# Altium schematic sheet Main.SchDoc
size 594 x 420 mm; SheetNumber: 1; Organization: Altium Limited; Address1: L3, 12a Rodborough Rd; Address2: Frenchs Forest; Address3: NSW; Address4: Australia 2086; PageSetup: Record=PageOptions|CenterHorizontal=False|CenterVertical=False|PrintScale=0.43|XCorrection=0.00|YCorrection=0.00|PrintKind=1|BorderSize=5000000|LeftOffset=0|BottomOffset=0|Orientation=2|PaperLength=5940|PaperWidth=4200|Scale=100|PaperSource=7|PrintQuality=-4|MediaType=1|DitherType=10|PaperKind=Personal. 1: 215,9 x 279,4 mm|PrintScaleMode=0
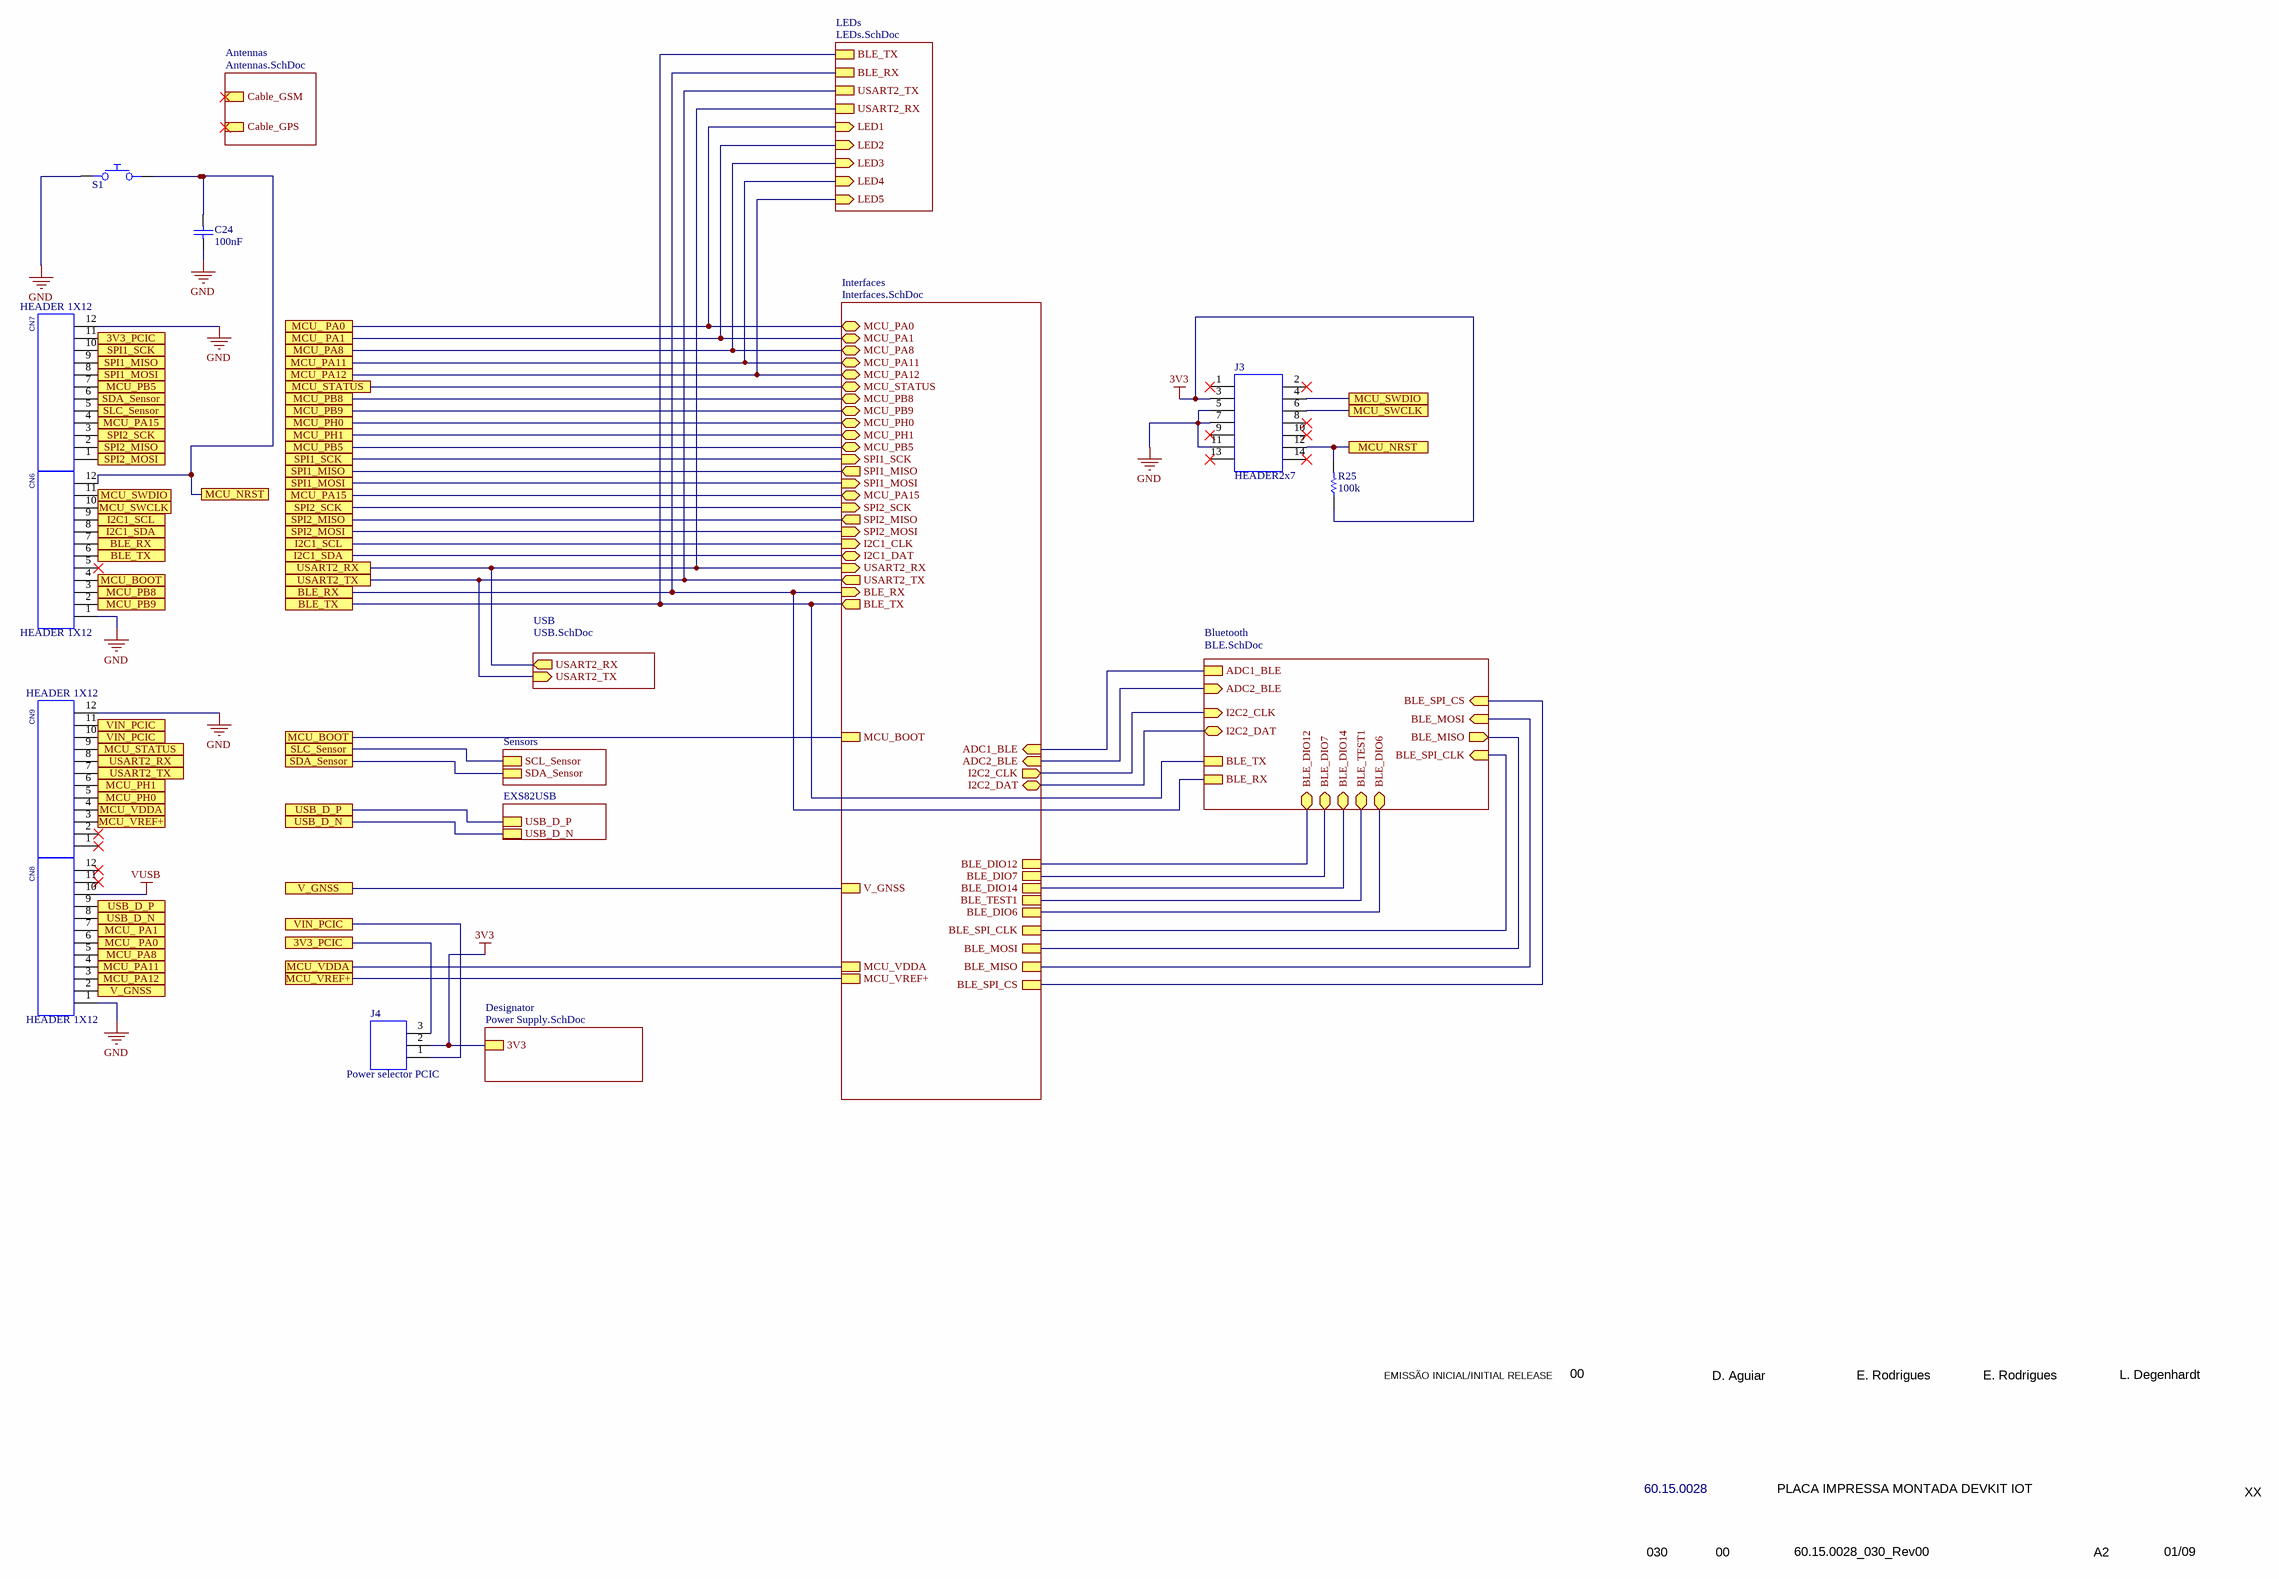
[diagram p0: Main.SchDoc]

## Parts
C24  Adicionado  [0201]  (value not drawn)
CN6  28.14.0552  [28.14.0552]  (value not drawn)
CN7  28.14.0552  [28.14.0552]  (value not drawn)
CN8  28.14.0552  [28.14.0552]  (value not drawn)
CN9  28.14.0552  [28.14.0552]  (value not drawn)
J3  value HEADER2x7  [70.11.0077]  (hidden comment: 70.11.0077)
J4  70.11.0083  [70.11.0083]  (value not drawn)
R25  value 100k  [0201]  (hidden comment: Adicionado)
S1  Adicionado  [PUSH_BUTTON]  (value not drawn)

## Sub-sheets
Antennas = Antennas.SchDoc: Cable_GSM, Cable_GPS
Bluetooth = BLE.SchDoc: ADC1_BLE, ADC2_BLE (in), I2C2_CLK (in), I2C2_DAT (bidir), BLE_TX, BLE_RX, BLE_SPI_CLK (in), BLE_MISO (out), BLE_MOSI (in), BLE_SPI_CS (in), BLE_DIO12 (bidir), BLE_DIO14 (bidir), BLE_DIO7 (bidir), BLE_DIO6 (bidir), BLE_TEST1 (bidir)
Designator = Power Supply.SchDoc: 3V3
EXS82USB = EXS82_USB.SchDoc: USB_D_P, USB_D_N
Interfaces = Interfaces.SchDoc: MCU_PB9 (bidir), MCU_PH0 (bidir), MCU_PH1 (bidir), MCU_PA0 (bidir), MCU_PA1 (bidir), MCU_PA8 (bidir), MCU_PA11 (bidir), MCU_PA12 (bidir), MCU_PA15 (bidir), SPI2_MOSI (in), SPI2_MISO (out), SPI2_SCK (in), I2C1_CLK (in), I2C1_DAT (bidir), SPI1_MOSI (in), SPI1_MISO (out), SPI1_SCK (in), USART2_RX (in), USART2_TX (out), BLE_TX (out), BLE_RX (in), ADC1_BLE (in), ADC2_BLE (in), MCU_PB5 (bidir), MCU_PB8 (bidir), BLE_DIO6, BLE_DIO7, BLE_DIO12, BLE_DIO14, BLE_TEST1, BLE_SPI_CS, BLE_SPI_CLK, BLE_MOSI, BLE_MISO, MCU_STATUS (bidir), MCU_BOOT, MCU_VDDA, MCU_VREF+, I2C2_CLK (out), I2C2_DAT (bidir), V_GNSS
LEDs = LEDs.SchDoc: LED1 (in), LED2 (in), LED3 (in), LED4 (in), LED5 (in), USART2_RX, USART2_TX, BLE_RX, BLE_TX
Sensors = Sensors.SchDoc: SCL_Sensor, SDA_Sensor
USB = USB.SchDoc: USART2_RX (out), USART2_TX (in)

## Ports
3V3_PCIC, BLE_RX, BLE_TX, I2C1_SCL, I2C1_SDA, MCU_ PA0, MCU_ PA1, MCU_BOOT, MCU_NRST, MCU_PA8, MCU_PA11, MCU_PA12, MCU_PA15, MCU_PB5, MCU_PB8, MCU_PB9, MCU_PH0, MCU_PH1, MCU_STATUS, MCU_SWCLK, MCU_SWDIO, MCU_VDDA, MCU_VREF+, SDA_Sensor, SLC_Sensor, SPI1_MISO, SPI1_MOSI, SPI1_SCK, SPI2_MISO, SPI2_MOSI, SPI2_SCK, USART2_RX, USART2_TX, USB_D_N, USB_D_P, V_GNSS, VIN_PCIC

## Nets
3V3: J3.3 J4.2 R25.1 ; sheet Designator/3V3
GND: C24.1 CN6.1 CN7.12 CN8.1 CN9.12 J3.5 J3.7 J3.11 S1.1
VUSB: CN8.10
3V3_PCIC: CN7.11 J4.3 ; port 3V3_PCIC
BLE_RX: CN6.7 ; port BLE_RX, sheet LEDs/BLE_RX, sheet Interfaces/BLE_RX, sheet Bluetooth/BLE_RX
BLE_TX: CN6.6 ; port BLE_TX, sheet LEDs/BLE_TX, sheet Interfaces/BLE_TX, sheet Bluetooth/BLE_TX
I2C1_SCL: CN6.9 ; port I2C1_SCL, sheet Interfaces/I2C1_CLK
I2C1_SDA: CN6.8 ; port I2C1_SDA, sheet Interfaces/I2C1_DAT
MCU_ PA0: CN8.6 ; port MCU_ PA0, sheet LEDs/LED1, sheet Interfaces/MCU_PA0
MCU_ PA1: CN8.7 ; port MCU_ PA1, sheet LEDs/LED2, sheet Interfaces/MCU_PA1
MCU_BOOT: CN6.4 ; port MCU_BOOT, sheet Interfaces/MCU_BOOT
MCU_NRST: C24.2 CN6.12 J3.12 R25.2 S1.2 ; port MCU_NRST
MCU_PA8: CN8.5 ; port MCU_PA8, sheet LEDs/LED3, sheet Interfaces/MCU_PA8
MCU_PA11: CN8.4 ; port MCU_PA11, sheet LEDs/LED4, sheet Interfaces/MCU_PA11
MCU_PA12: CN8.3 ; port MCU_PA12, sheet LEDs/LED5, sheet Interfaces/MCU_PA12
MCU_PA15: CN7.4 ; port MCU_PA15, sheet Interfaces/MCU_PA15
MCU_PB5: CN7.7 ; port MCU_PB5, sheet Interfaces/MCU_PB5
MCU_PB8: CN6.3 ; port MCU_PB8, sheet Interfaces/MCU_PB8
MCU_PB9: CN6.2 ; port MCU_PB9, sheet Interfaces/MCU_PB9
MCU_PH0: CN9.5 ; port MCU_PH0, sheet Interfaces/MCU_PH0
MCU_PH1: CN9.6 ; port MCU_PH1, sheet Interfaces/MCU_PH1
MCU_STATUS: CN9.9 ; port MCU_STATUS, sheet Interfaces/MCU_STATUS
MCU_SWCLK: CN6.10 J3.6 ; port MCU_SWCLK
MCU_SWDIO: CN6.11 J3.4 ; port MCU_SWDIO
MCU_VDDA: CN9.4 ; port MCU_VDDA, sheet Interfaces/MCU_VDDA
MCU_VREF+: CN9.3 ; port MCU_VREF+, sheet Interfaces/MCU_VREF+
SDA_Sensor: CN7.6 ; port SDA_Sensor, sheet Sensors/SDA_Sensor
SLC_Sensor: CN7.5 ; port SLC_Sensor, sheet Sensors/SCL_Sensor
SPI1_MISO: CN7.9 ; port SPI1_MISO, sheet Interfaces/SPI1_MISO
SPI1_MOSI: CN7.8 ; port SPI1_MOSI, sheet Interfaces/SPI1_MOSI
SPI1_SCK: CN7.10 ; port SPI1_SCK, sheet Interfaces/SPI1_SCK
SPI2_MISO: CN7.2 ; port SPI2_MISO, sheet Interfaces/SPI2_MISO
SPI2_MOSI: CN7.1 ; port SPI2_MOSI, sheet Interfaces/SPI2_MOSI
SPI2_SCK: CN7.3 ; port SPI2_SCK, sheet Interfaces/SPI2_SCK
USART2_RX: CN9.8 ; port USART2_RX, sheet LEDs/USART2_RX, sheet USB/USART2_RX, sheet Interfaces/USART2_RX
USART2_TX: CN9.7 ; port USART2_TX, sheet LEDs/USART2_TX, sheet USB/USART2_TX, sheet Interfaces/USART2_TX
USB_D_N: CN8.8 ; port USB_D_N, sheet EXS82USB/USB_D_N
USB_D_P: CN8.9 ; port USB_D_P, sheet EXS82USB/USB_D_P
V_GNSS: CN8.2 ; port V_GNSS, sheet Interfaces/V_GNSS
VIN_PCIC: CN9.10 CN9.11 J4.1 ; port VIN_PCIC
(unnamed): sheet Interfaces/ADC1_BLE, sheet Bluetooth/ADC1_BLE
(unnamed): sheet Interfaces/ADC2_BLE, sheet Bluetooth/ADC2_BLE
(unnamed): sheet Interfaces/BLE_DIO6, sheet Bluetooth/BLE_DIO6
(unnamed): sheet Interfaces/BLE_DIO7, sheet Bluetooth/BLE_DIO7
(unnamed): sheet Interfaces/BLE_DIO12, sheet Bluetooth/BLE_DIO12
(unnamed): sheet Interfaces/BLE_DIO14, sheet Bluetooth/BLE_DIO14
(unnamed): sheet Interfaces/BLE_TEST1, sheet Bluetooth/BLE_TEST1
(unnamed): sheet Interfaces/BLE_SPI_CS, sheet Bluetooth/BLE_SPI_CS
(unnamed): sheet Interfaces/BLE_SPI_CLK, sheet Bluetooth/BLE_SPI_CLK
(unnamed): sheet Interfaces/BLE_MOSI, sheet Bluetooth/BLE_MISO
(unnamed): sheet Interfaces/BLE_MISO, sheet Bluetooth/BLE_MOSI
(unnamed): sheet Interfaces/I2C2_CLK, sheet Bluetooth/I2C2_CLK
(unnamed): sheet Interfaces/I2C2_DAT, sheet Bluetooth/I2C2_DAT

Not connected (* = marked no-connect by the designer): CN6 5*; CN8 11* 12*; CN9 1* 2*; J3 1* 2* 8* 9* 10* 13* 14*

## Notes on the sheet
- (near J4) Power selector PCIC
- EMISSÃO INICIAL/INITIAL RELEASE
- 00
- D. Aguiar
- E. Rodrigues
- L. Degenhardt
- 60.15.0028
- PLACA IMPRESSA MONTADA DEVKIT IOT
- XX
- 030
- 60.15.0028_030_Rev00
- A2
- 01/09
- 1
- 2
- 3
- 4
- 5
- 6
- 7
- 8
- A
- B
- C
- D
- E
- F
- G
- H
- HISTORICO DA REV / EVOLUTION
- REV
- DATA / DATE
- DOCUMENTO DE ENGENHARIA DE PRODUTO
- ELABORADO / DRAWN
- DOCUMENT OF PRODUCT ENGINEERING
- VERIFICADO / CHECKED
- APROVADO / APPROVED
- QUALIDADE / QUALITY
- CÓDIGO / CODE
- DESCRIÇÃO / DESCRIPTION
- DOC
- ARQUIVO / FILE
- FORM./SIZE
- FOLHA / PAGE
- (in symbol 28.14.0552) HEADER 1X12
- (in symbol 0201X104J100CT) 100nF

## Library data of the parts
C24 = 0201X104J100CT: CAPACITOR CERAMICO 100nF 10V 5% X5R SMD 0201
CN6-CN9 = 28.14.0552: CONECTOR HEADER FM 12 VIAS 180G P/PCB
J3 = 70.11.0077: BARRA PINOS 2X7 1,27mm VERTICAL MACHO; Part Number: 67997-428HLF; Manufactor: AMPHENOL FCI
J4 = 70.11.0083: BARRA TERMINAIS 180G 1X3 POSICOES 2,54MM
R25 = RC0201FR-07100KL: RESISTOR THICK FILM 100k OHMS 25V 50mW 1% SMD 0201
S1 = Push Button: TACTILE SWITCH SPST 0.05A 12VDC SMD; Manufacturer: C&K Switches; Part Number: PTS540JK035SMTRLFS; Voltage Rating (DC): 12V; Current Rating: 50mA; Switch Function: Off-On; Operating Force: 230gf; Library Control - Checked Footprint: Yes; Library Control - Person that Checked Schematic: Nícolas; Bounce time (MAX): 10ms; ComponentLink1Description: Datasheet; ComponentLink1URL: https://www.mouser.com/datasheet/2/60/pts540-1841856.pdf; ComponentLink2Description: Mouser Link; ComponentLink2URL: https://www.mouser.com/ProductDetail/CK/PTS540JK035SMTRLFS?qs=nsc5Ve2%252BdoHscnqTjIh87g%3D%3D; Supplier 1: Mouser; Category: Tactile Switches; Pricing 1: 1=0,18, 10=0,174, 100=0,15, 500=0,122, 1000=0,103 (USD); Throw Configuration: SPST; Orientation: Straight; Supplier Part Number 1: 611-PTS540JK035SMTRL; Library Ref: Diversos; Library Control - Checked Schematic: Yes; Library Control - Person that Checked Footprint: Nícolas; Library Control - Person that did the Last Update Schematic: Nícolas